# EAGLE design ASD2020 (EAGLE 6.3)
DATABASE: ./../../../../../Components/TinyCircuits_Part_Database.txt
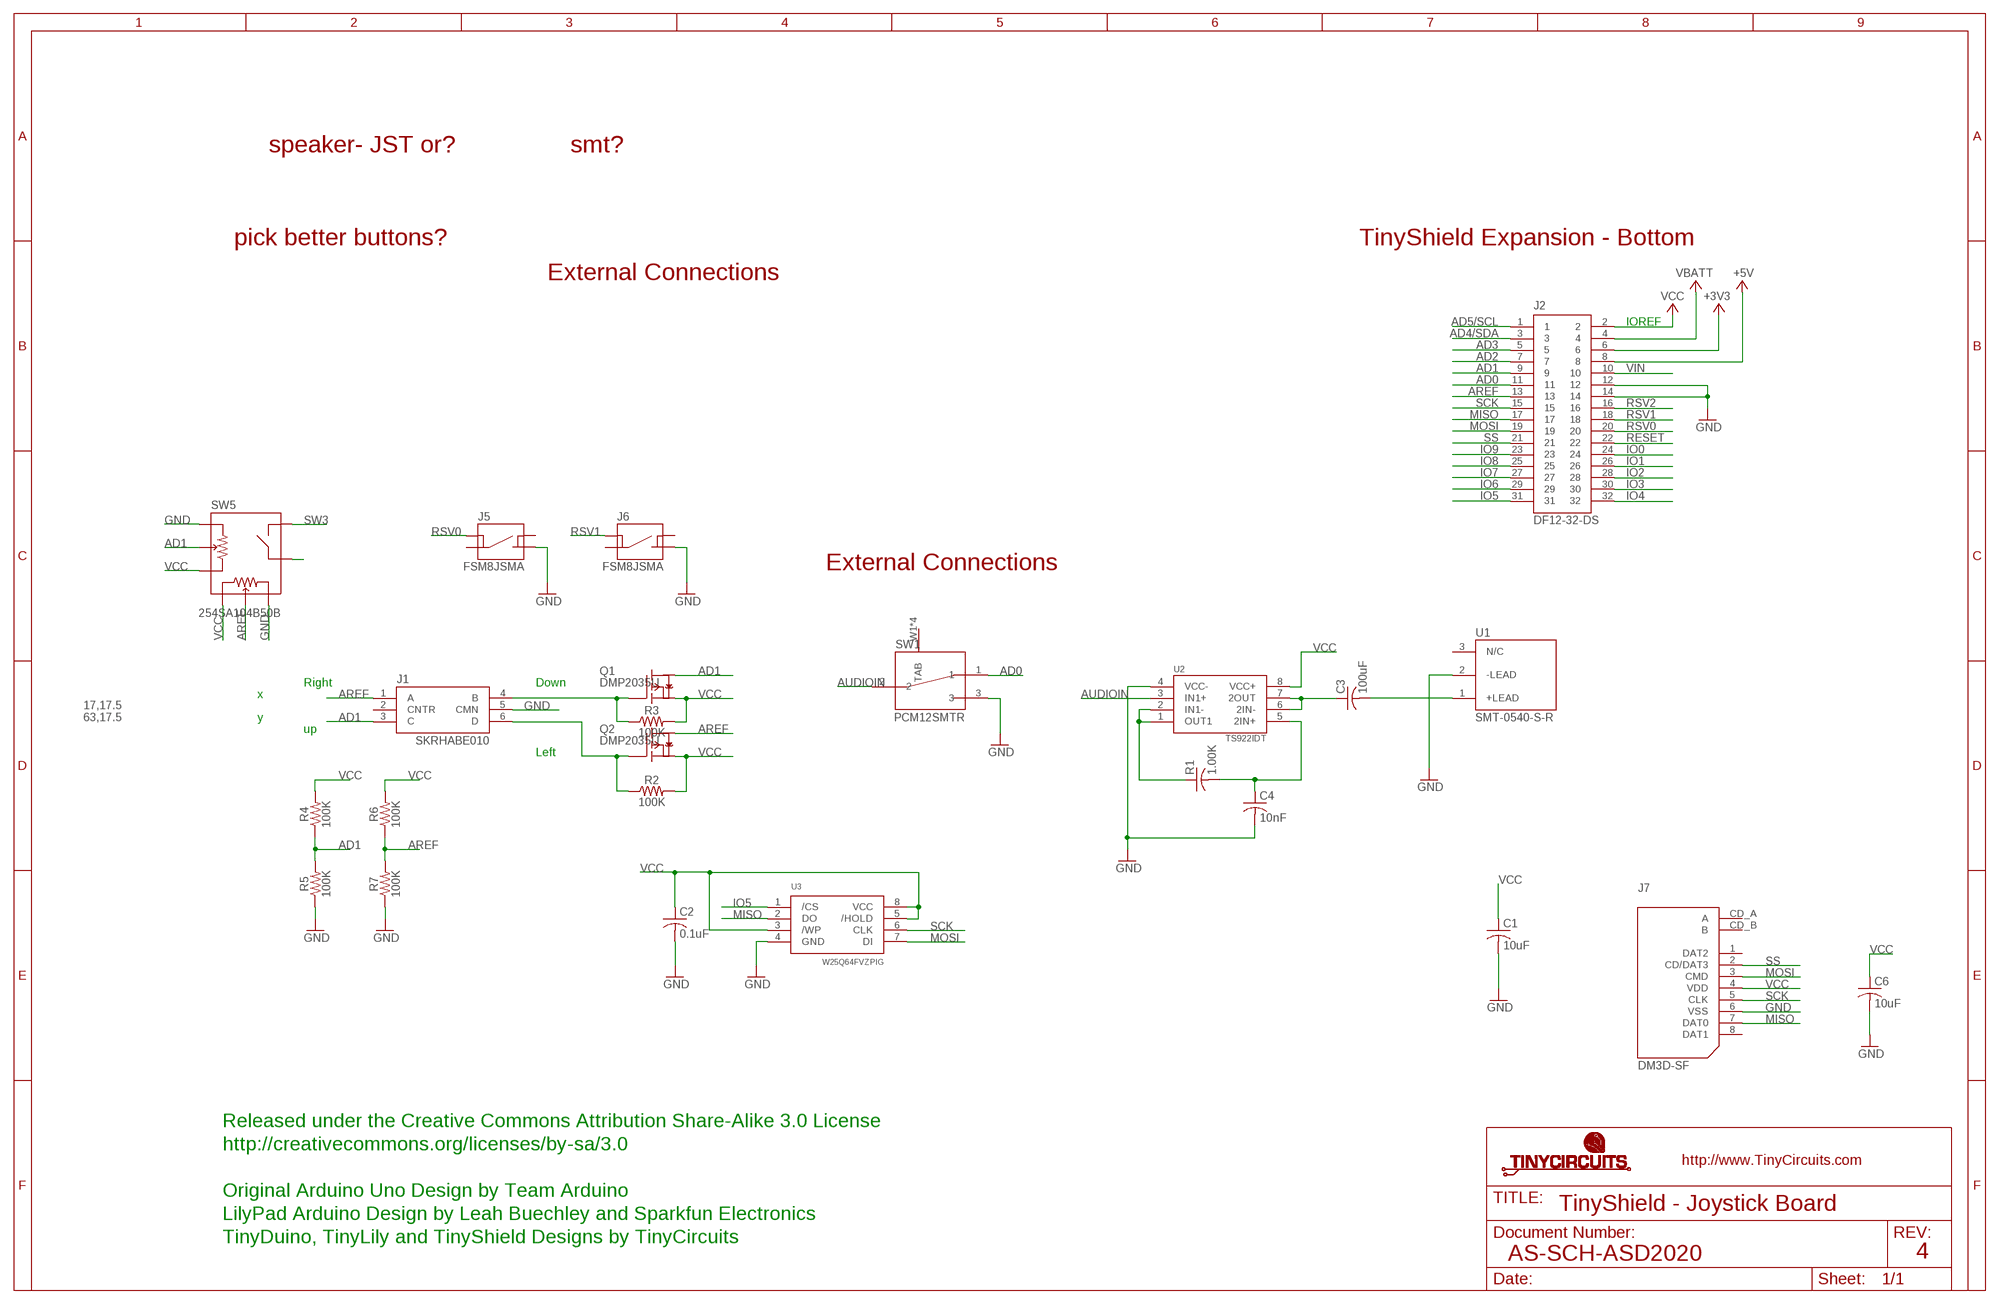
[diagram p0: schematic, sheet 1]

## Parts
C1  10uF  AS-ITM-00002  [C0603]
C2  0.1uF  AS-ITM-00008  [C0402]
C3  100uF  AS-ITM-00095  [C1206]
C4  10nF  AS-ITM-00084  [C0402]
C6  10uF  AS-ITM-00002  [C0603]
J1  SKRHABE010  AS-ITM-00305  [SKRHA]
J2  DF12-32-DS  AS-ITM-00012  [DF12-32-DS]
J5  FSM8JSMA  AS-ITM-00278  [SWITCH-FSM/JSM]
J6  FSM8JSMA  AS-ITM-00278  [SWITCH-FSM/JSM]
J7  DM3D-SF  AS-ITM-00047  [SD_CARD]
Q1  DMP2035U  AS-ITM-00024  [SOT23]
Q2  DMP2035U  AS-ITM-00024  [SOT23]
R1  1.00K  AS-ITM-00008  [C0402]
R2  100K  AS-ITM-00004  [0402]
R3  100K  AS-ITM-00004  [0402]
R4  100K  AS-ITM-00004  [0402]
R5  100K  AS-ITM-00004  [0402]
R6  100K  AS-ITM-00004  [0402]
R7  100K  AS-ITM-00004  [0402]
SW1  PCM12SMTR  AS-ITM-00220  [PCM12SMTR]
SW5  254SA104B50B  AS-ITM-00229  [JOYSTICK_CTS_254]
U1  SMT-0540-S-R  AS-ITM-00144  [SMT-0540-S-R]
U2  TS922IDT  AS-ITM-000922  [SO-08-COMPACT]
U3  W25Q64FVZPIG  AS-ITM-00263  [8-WSON-6X5]

## Nets
+3V3: J2.6
+5V: J2.8
AD0: J2.11 SW1.1
AD1: J1.3(C) J2.9 Q1.C(D) R4.1 R5.2 SW5.A2
AD2: J2.7
AD3: J2.5
AD4/SDA: J2.3
AD5/SCL: J2.1
AREF: J1.1(A) J2.13 Q2.C(D) R6.1 R7.2 SW5.B2
AUDIOIN: SW1.2 U2.3(IN1+)
GND: C1.2 C2.2 C4.2 C6.2 J1.5(CMN) J2.12 J2.14 J5.P$3 J6.P$3 J7.6(VSS) R5.1 R7.1 SW1.3 SW5.A1 SW5.B3 U1.2(-LEAD) U2.4(VCC-) U3.4(GND)
IO0: J2.24
IO1: J2.26
IO2: J2.28
IO3: J2.30
IO4: J2.32
IO5: J2.31 U3.1(/CS)
IO6: J2.29
IO7: J2.27
IO8: J2.25
IO9: J2.23
MISO: J2.17 J7.7(DAT0) U3.2(DO)
MOSI: J2.19 J7.3(CMD) U3.7(DI)
N$1: C3.1 U2.6(2IN-) U2.7(2OUT)
N$2: C3.2 U1.1(+LEAD)
N$4: SW5.S2
N$7: C4.1 R1.2 U2.5(2IN+)
N$9: R1.1 U2.1(OUT1) U2.2(IN1-)
N$12: J1.4(B) Q1.B(G) R3.1
N$13: J1.6(D) Q2.B(G) R2.1
RESET: J2.22
RSV0: J2.20 J5.P$1
RSV1: J2.18 J6.P$1
RSV2: J2.16
SCK: J2.15 J7.5(CLK) U3.6(CLK)
SS: J2.21 J7.2(CD/DAT3)
SW3: SW5.S1
VBATT: J2.4
VCC: C1.1 C2.1 C6.1 J2.2 J7.4(VDD) Q1.E(S) Q2.E(S) R2.2 R3.2 R4.2 R6.2 SW5.A3 SW5.B1 U2.8(VCC+) U3.3(/WP) U3.5(/HOLD) U3.8(VCC)
VIN: J2.10
Unconnected: J1.2(CNTR) J5.P$2 J5.P$4 J6.P$2 J6.P$4 J7.1(DAT2) J7.8(DAT1) J7.CD_A(A) J7.CD_B(B) SW1.W1(TAB) SW1.W2(TAB) SW1.W3(TAB) SW1.W4(TAB) U1.3(N/C)

## Notes on the sheet
- speaker- JST or? | smt?
- pick better buttons? | TinyShield Expansion - Bottom
- External Connections
- IOREF
- External Connections
- Right | Down
- x
- 17,17.5
  63,17.5
- y
- up
- Left
- Released under the Creative Commons Attribution Share-Alike 3.0 License
- http://creativecommons.org/licenses/by-sa/3.0
- Original Arduino Uno Design by Team Arduino
- TinyShield - Joystick Board
- LilyPad Arduino Design by Leah Buechley and Sparkfun Electronics
- TinyDuino, TinyLily and TinyShield Designs by TinyCircuits
- AS-SCH-ASD2020 | 4

## Library data of the parts
C1 C6 = tinycircuits:AS-ITM-00002: CAP CER 10UF 10V 20% X5R 0603; PARTNO: AS-ITM-00002
C2 = tinycircuits:AS-ITM-00008: CAP CER 0.1UF 16V 10% X5R 0402; PARTNO: AS-ITM-00008
C3 = tinycircuits:AS-ITM-00095: CAP CER 100UF 10V 20% X5R 1206; PARTNO: AS-ITM-00095
C4 = tinycircuits:AS-ITM-00084: CAP CER 10NF 25V 10% X7R 0402; PARTNO: AS-ITM-00084
J1 = tinycircuits:AS-ITM-00305: Multi-Directional Switches 4-directn cntr push W/boss 200K Cycles; PARTNO: AS-ITM-00305
J2 = tinycircuits:AS-ITM-00012: CONN RECEPT 32POS 3MM SMD 0.5MM; PARTNO: AS-ITM-00012
J5 J6 = tinycircuits:AS-ITM-00278: SWITCH TACTILE SPST-NO 0.05A 24V; PARTNO: AS-ITM-00278
J7 = tinycircuits:AS-ITM-00047: CONN MICRO SD R/A PUSH-PULL SMD; PARTNO: AS-ITM-00047
Q1 Q2 = tinycircuits:AS-ITM-00024: P-Channel MOSFET SOT-23; PARTNO: AS-ITM-00024
R1 = tinycircuits:AS-ITM-00008: CAP CER 0.1UF 16V 10% X5R 0402; PARTNO: AS-ITM-00008; VALUE: 0.1uF
R2-R7 = tinycircuits:AS-ITM-00004: RES 100K OHM 1/16W 1% 0402; PARTNO: AS-ITM-00004
SW1 = tinycircuits:AS-ITM-00220: SW SLIDE SP2T 6VDC 0.3A SMT; PARTNO: AS-ITM-00220
SW5 = tinycircuits:AS-ITM-00229: POT JOYSTICK 10K OHM W/SWITCH; PARTNO: AS-ITM-00229
U1 = tinycircuits:AS-ITM-00144: BUZZER MAGNETIC 3V 5MM SMD; PARTNO: AS-ITM-00144
U2 = tinycircuits:AS-ITM-00092: IC OPAMP GP 4MHZ RRO 8SO; PARTNO: AS-ITM-00092
U3 = tinycircuits:AS-ITM-00263: IC FLASH 64MBIT 104MHZ 8WSON; PARTNO: AS-ITM-00263

## Board
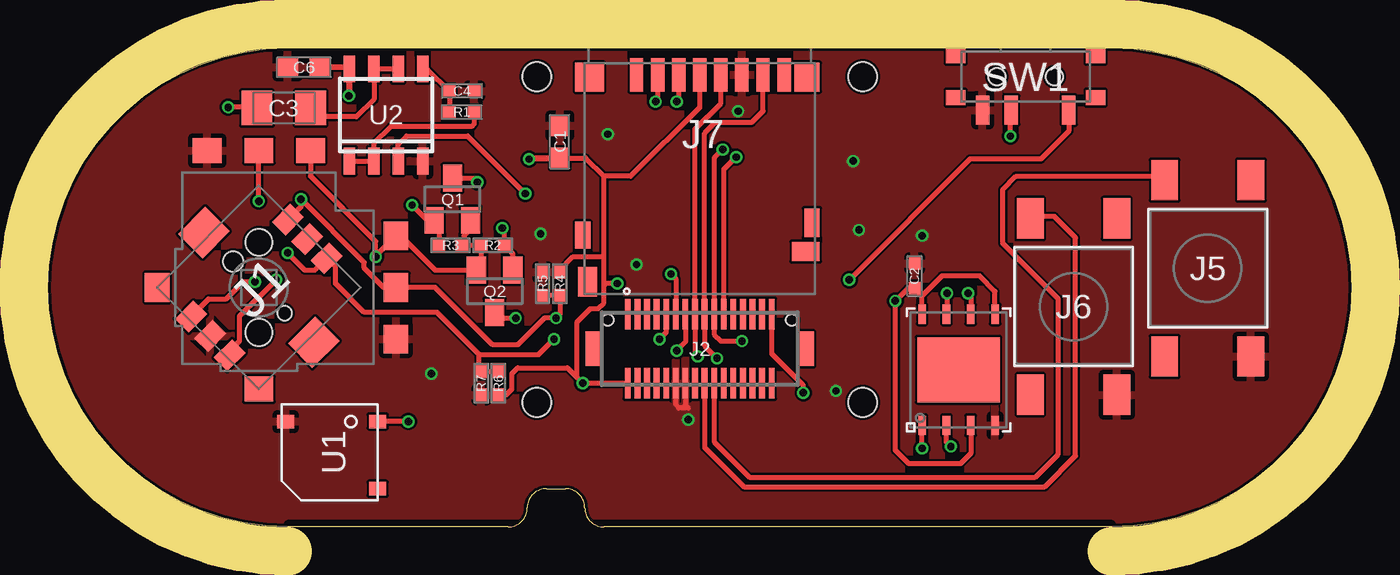
[diagram p1: board, top side]
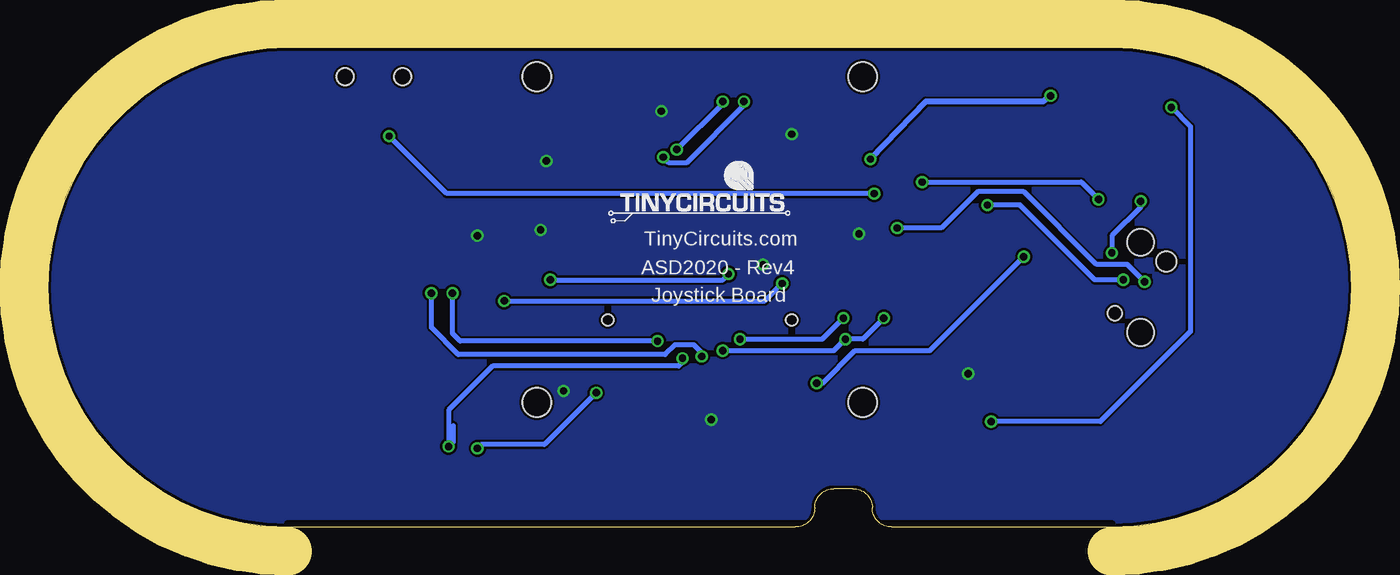
[diagram p2: board, bottom side, seen from below]

Size 68 x 25 mm. Coordinates in mm from the lower left corner, seen from the top.
Outline: 12.5,25 55.5,25 arc-90 68,12.5 arc-90 55.5,0 29,0 arc-90 28,1 arc90 27,2 26,2 arc90 25,1 arc-90 24,0 12.5,0 arc-90 0,12.5 arc-90 12.5,25
Copper layers (1*16): Top 0.035mm / dielectric 1.5mm / Bottom 0.035mm
Design rules "default *": minimum track width 8mil, minimum drill 15mil, track to track 5mil, track to pad 5mil, pad to pad 5mil, via to via 6mil, smd to smd 5mil, copper to edge 6mil, drill to drill 8mil, minimum pad ring 10mil, minimum via ring 5mil, stop-mask expansion 4mil, vias tented up to drill 25mil, thermal gap 10mil
Holes 1.5 mm at 25.5,23.5 42.5,23.5 42.5,6.5 25.5,6.5
tRestrict: 1 lines
bRestrict: 1 lines
Milling: 5 lines

### Footprints (pad centres in the part's own frame; a part is rotated, then mirrored left to right if it is on the bottom)
C0603 = smd 1.1 x 1: 1 -0.85,0; 2 0.85,0
C0402 = smd 0.65 x 0.6: 1 -0.65,0; 2 0.65,0
C1206 = smd 1.6 x 1.8: 1 -1.4,0; 2 1.4,0
SKRHA = smd 1.35 x 1: 1 -3.575,1.425; 2 -3.575,0; 3 -3.575,-1.425; 4 3.575,1.425; 5 3.575,0; 6 3.575,-1.425 | smd 2 x 1.8: T1 0,4.05; T2 0,-4.05 | hole 1.05: 0,-1.9 | hole 0.75: 0,1.9
DF12-32-DS = smd 0.3 x 1.6: 1 -3.75,1.8; 2 -3.75,-1.8; 3 -3.25,1.8; 4 -3.25,-1.8; 5 -2.75,1.8; 6 -2.75,-1.8; 7 -2.25,1.8; 8 -2.25,-1.8; 9 -1.75,1.8; 10 -1.75,-1.8; 11 -1.25,1.8; 12 -1.25,-1.8; 13 -0.75,1.8; 14 -0.75,-1.8; 15 -0.25,1.8; 16 -0.25,-1.8; 17 0.25,1.8; 18 0.25,-1.8; 19 0.75,1.8; 20 0.75,-1.8; 21 1.25,1.8; 22 1.25,-1.8; 23 1.75,1.8; 24 1.75,-1.8; 25 2.25,1.8; 26 2.25,-1.8; 27 2.75,1.8; 28 2.75,-1.8; 29 3.25,1.8; 30 3.25,-1.8; 31 3.75,1.8; 32 3.75,-1.8 | smd 0.9 x 1.8: F1 -5.5,0; F2 5.5,0 | hole 0.6: -4.8,1.5; 4.8,1.5
SWITCH-FSM/JSM = smd 1.4 x 2.1: P$1 -2.25,4.6; P$2 2.25,4.6; P$3 2.25,-4.6; P$4 -2.25,-4.6
SD_CARD = smd 0.7 x 1.75: 1 3.3,0; 2 2.2,0; 3 1.1,0; 4 0,0; 5 -1.1,0; 6 -2.2,0; 7 -3.3,0; 8 -4.4,0 | smd 1.3 x 1.5: 9 -5.6,0.125 | smd 1.5 x 1.5: 10 5.75,0.125 | smd 0.8 x 1.5: 11 -5.85,7.725 | smd 0.8 x 1.4: 13 6.1,8.375 | smd 1 x 1.55: CD_A 5.85,10.8 | smd 1.45 x 1: CD_B -5.525,9.225
SOT23 = smd 1 x 1.4: B -0.95,-1.1; C 0,1.1; E 0.95,-1.1
0402 = smd 0.65 x 0.55: 1 -0.6,0; 2 0.6,0
PCM12SMTR = smd 0.7 x 1.5: 1 -2.25,1.75; 2 0.75,1.75; 3 2.25,1.75 | smd 1 x 0.8: W1 -3.65,1.1; W2 -3.65,-1.1; W3 3.65,-1.1; W4 3.65,1.1 | hole 0.9: 1.5,0; -1.5,0
JOYSTICK_CTS_254 = smd 1.3 x 1.5: A1 -7.15,2.7; A2 -7.15,0; A3 -7.15,-2.7; S2 5.3,0 | smd 1.5 x 1.3: B1 -2.7,-7.15; B2 0,-7.15; B3 2.7,-7.15; S1 0,5.3 | hole 1.4: 0,-2.35; 0,2.35
SMT-0540-S-R = smd 0.7 x 0.9: 1 1.6,-2.3; 2 1.6,2.5; 3 -1.9,-2.3
SO-08-COMPACT = smd 0.6 x 1.4: 1 -1.905,-2.4; 2 -0.635,-2.4; 3 0.635,-2.4; 4 1.905,-2.4; 5 1.905,2.4; 6 0.635,2.4; 7 -0.635,2.4; 8 -1.905,2.4
8-WSON-6X5 = smd 1 x 0.4: 1 -2.9,1.905; 2 -2.9,0.635; 3 -2.9,-0.635; 4 -2.9,-1.905; 5 2.9,-1.905; 6 2.9,-0.635; 7 2.9,0.635; 8 2.9,1.905 | smd 3.4 x 4.3: P$1 0,0

### Placement (x,y rotation side)
C1  26.7,20.1 90 top
C2  45.2,13.1 90 top
C3  12.3,21.86 180 top
C4  21.59,22.75 0 top
C6  13.35,23.99 180 top
J1  11,12.5 225 top
J2  34,9.3 0 top
J5  60.5,13.5 0 top
J6  53.5,11.5 0 top
J7  34,23.6 180 top
Q1  21.1,17.1 0 top
Q2  23.3,12.3 180 top
R1  21.59,21.65 180 top
R2  23.2,14.7 180 top
R3  21,14.7 0 top
R4  26.7,12.7 90 top
R5  25.8,12.7 270 top
R6  23.5,7.5 270 top
R7  22.6,7.5 90 top
SW1  51,23.5 180 top
SW5  11,12.5 180 top
U1  14.9,3.9 90 top
U2  17.64,21.5 0 top
U3  47.5,8.2 90 top
U$1  [DOCFIELD-TINYCIRCUITS-PCB]  77.91,-5 0 top  (outside the outline)

### Tracks (layer width: path | path; a pad name or v marks a point on that pad's centre or on a via)
AD0  (via drill 0.38)
  Top 0.254: SW1.1 53.25,20.65 51.8,19.2 48.1,19.2 v41.8,12.9 | v32.5,13.2 32.75,12.95 J2.11
  Bottom 0.254: v41.8,12.9 32.8,12.9 v32.5,13.2
AD1  (via drill 0.38)
  Top 0.254: J2.9 32.25,10.15 v31.9,9.8 | R5.2 R4.1 26.7,11.1 v26.5,10.9 25.9,10.9 24.5,9.5 23.2,9.5 20.2,12.5 SW5.A2 17.5,12.5 16.5,13.5 16.5,13.8 v13.2,17.1 13.2,16.71 J1.3 12.89,16.4 | Q1.C 22.2,18.2 v22.4,18
  Bottom 0.254: v31.9,9.8 27.6,9.8 v26.5,10.9 | v22.4,18 14.1,18 v13.2,17.1
AREF  (via drill 0.38)
  Top 0.254: J2.13 33.25,9.65 v32.8,9.2 | 22.5,9 20.3,11.2 16.5,11.2 15,12.7 15,13.56 J1.1 13.91,13.4 13.4,13.4 v12.5,14.3 | v11,17 SW5.B2 | 22.5,9 25.6,9 v26.4,9.8 | R6.1 R7.2 22.5,8.1 22.5,9 | Q2.C 23.6,10.9 v24.4,10.9
  Bottom 0.254: v32.8,9.2 27,9.2 v26.4,9.8 25.5,9.8 v24.4,10.9 | v11,17 11,16.7 12.5,15.2 v12.5,14.3
AUDIOIN  (via drill 0.38)
  Top 0.254: U2.3 18.27,19.98 18.7,20.4 21.9,20.4 v24.9,17.4 | v50.2,20.4 50.2,21.7 SW1.2
  Bottom 0.254: v24.9,17.4 47.2,17.4 v50.2,20.4
GND  (via drill 0.38)
  Top 0.254: J2.14 33.25,6.35 33.4,6.2 32.9,6.2 32.75,6.4 32.75,7.4 32.8,7.5 32.9,7.4
  other vias: 36,21.7 33.4,5.6 30.7,13.7 25.7,15.3 45.6,15.2 42,19.1 42.3,15.5 41.1,7.1 20,8 29.2,20.5
  pour Top: 12.5,25 55.5,25 arc-90 68,12.5 arc-90 55.5,0 12.5,0 arc-90 0,12.5 arc-90
  pour Bottom: 12.5,25 55.5,25 arc-90 68,12.5 arc-90 55.5,0 12.5,0 arc-90 0,12.5 arc-90
IO5  (via drill 0.38)
  Top 0.254: J2.31 37.75,9.05 39.3,7.5 39.4,7.4 v39.4,7 | v45.6,4.1 U3.1
  Bottom 0.254: v39.4,7 42.1,4.3 45.4,4.3 v45.6,4.1
MISO  (via drill 0.38)
  Top 0.254: J7.7 37.3,21.7 36.7,21.1 34.8,21.1 34.25,20.55 J2.17 34.25,9.45 v34.9,8.8 | v47.1,4.2 46.87,4.44 U3.2
  Bottom 0.254: U3.2 46.87,4.44 v47.1,4.2 47.1,6.1 44.8,8.4 35.1,8.4 34.9,8.6 v34.9,8.8
MOSI  (via drill 0.38)
  Top 0.254: J7.3 32.9,22.3 v32.8,22.2 | v35.2,19.7 34.75,19.25 J2.19 34.75,10.05 35.1,9.7 v36.2,9.7 | v46.9,12.2 46.9,11.14 U3.7
  Bottom 0.254: v32.8,22.2 32.8,22.1 v35.2,19.7 | v46.9,12.2 46.9,10.1 46.5,9.7 v36.2,9.7
N$1
  Top 0.254: U2.6 U2.7 17,22.3 16.1,21.4 14.44,21.4 C3.1
N$2  (via drill 0.38)
  Top 0.254: C3.2 10.86,21.9 v9.4,21.9 | v18.8,5.5 U1.1
  Bottom 0.254: v9.4,21.9 8.4,20.9 8.4,10.2 13.1,5.5 v18.8,5.5
N$7
  Top 0.254: U2.5 19.79,23.9 C4.1 R1.2
N$9
  Top 0.254: U2.1 U2.2 17,20 17.9,20.9 22.1,20.9 22.24,21.04 R1.1
N$12  (via drill 0.38)
  Top 0.254: J1.4 9.48,9.18 10,9.7 10,11 v11.9,12.9 | v19,16.8 19.8,16 Q1.B 20.4,15.75 R3.1
  Bottom 0.254: v19,16.8 17.3,16.8 13.4,12.9 v11.9,12.9
N$13  (via drill 0.38)
  Top 0.254: Q2.B 24.25,14.25 R2.1 23.8,15.5 v23.7,15.6 | J1.6 8.38,11.9 9.3,11.9 10.2,12.8 v10.8,12.8
  Bottom 0.254: v23.7,15.6 21.4,15.6 19.5,17.5 17.1,17.5 13.3,13.7 11.7,13.7 v10.8,12.8
RSV0
  Top 0.254: J2.20 34.75,4.45 36.6,2.6 51.5,2.6 52.7,3.8 52.7,11.9 49.8,14.8 49.8,17.6 50.5,18.3 58.05,18.3 J5.P$1
RSV1
  Top 0.254: J2.18 34.25,4.15 36.3,2.1 52,2.1 53.6,3.7 53.6,15.1 52.5,16.2 51.35,16.2 J6.P$1
SCK  (via drill 0.38)
  Top 0.254: J7.5 35.1,22.1 33.75,20.75 J2.15 33.75,9.05 v33.9,8.9 | v48,12.2 48.13,12.07 U3.6
  Bottom 0.254: v48,12.2 48,10.4 46.6,9 35.8,9 35.3,9.5 34.3,9.5 33.9,9.1 v33.9,8.9
SS  (via drill 0.38)
  Top 0.254: J7.2 31.8,22.3 v31.7,22.2 | v35.9,19.3 35.25,18.65 J2.21
  Bottom 0.254: v31.7,22.2 31.7,22 34.7,19 35.6,19 v35.9,19.3
VCC  (via drill 0.38)
  Top 0.254: J2.2 v27.9,7.5 27.6,7.8 | 27.6,7.8 27.6,10.7 28.3,11.4 28.7,11.4 29,11.7 29,12.6 | 29,12.6 29,14 | 29,14 29,18.3 | J7.4 34,21.9 30.4,18.3 29,18.3 | U2.8 15.64,23.99 C6.1 | SW5.B1 13.7,18.3 17.1,14.9 17.1,14.15 | 14.15,24.04 C6.1 | C1.1 28.05,19.25 29,18.3 | R6.2 23.9,6.9 24.2,7.2 24.2,8 24.5,8.3 27.1,8.3 27.6,7.8 | Q1.E 22.05,15.55 21.7,15.2 21.7,14.8 R3.2 R2.2 22.6,13.65 Q2.E 20.2,13.4 18.4,15.2 SW5.A3 17.1,14.15 | R4.2 26.7,13.4 27.4,14.1 28.9,14.1 29,14 | 17.1,14.15 v17.1,14.1 | C6.1 15.7,24 | U3.3 48.13,3.84 47.6,3.3 44.9,3.3 44.2,4 v44.2,11.8 44.85,12.45 C2.1 45.59,12.05 | U3.8 45.59,12.05 | v29.7,12.7 29.1,12.7 29,12.6 | U3.5 49.41,12.3 48.6,13.1 46.64,13.1 45.59,12.05
  Top 0.305: 15.7,24 v15.7,22.5 | v25.1,19.2 25.15,19.25 C1.1
  Bottom 0.254: v27.9,7.5 27.6,7.5 25.9,9.2 22,9.2 v17.1,14.1 | v44.2,11.8 30.6,11.8 v29.7,12.7
  Bottom 0.305: v15.7,22.5 16.1,22.2 22.2,22.2 v25.1,19.2

### Text on the board
bPlace: TinyCircuits.com | ASD2020 - Rev4 | Joystick Board
tRestrict: ^ V-SCORE EDGE ALONG OUTLINE ^
Document: FABRICATION DRAWING | NOTES: | 1. PRINTED CIRCUIT BOARD MADE FROM NEMA GRADE FR-4 EPOXY LAMINATE | WITH 1 OUNCE COPPER PLATING AND .024 THICKNESS. | 2. ALL DIMENSIONS ARE GIVEN IN INCHES. | 3. CIRCUIT PATHS ARE FOR REFERENCE ONLY. | 4. HOLE SIZES SHOWN ARE FINISHED DIAMETERS AFTER PLATING. | 5. BOARD PLATED USING REFLOW OR SIMILAR METHOD. | 6. BOARD TO HAVE BLUE SOLDER MASK ON PLATED SURFACES USING WET FILM | 7. SILKSCREEN BOARD USING WHITE INK. | SR100 OR SR1010 EPOXY. EQUIVALENT WET OR DRY FILM MAY BE USED. | 8. THE FOLLOWING INFORMATION APPLIES TO THIS BOARD: | * 2 COPPER LAYERS | * .024 BOARD THICKNESS | * REQUIRES TOP SIDE SILKSCREEN | Released under the Creative Commons Attribution Share-Alike 3.0 License | http://creativecommons.org/licenses/by-sa/3.0 | Original Arduino Uno Design by Team Arduino | LilyPad Arduino Design by Leah Buechley and Sparkfun Electronics | TinyDuino, TinyLily and TinyShield Designs by TinyCircuits | TinyShield - Joystick Board | AS-PCB-ASD2020 | 4